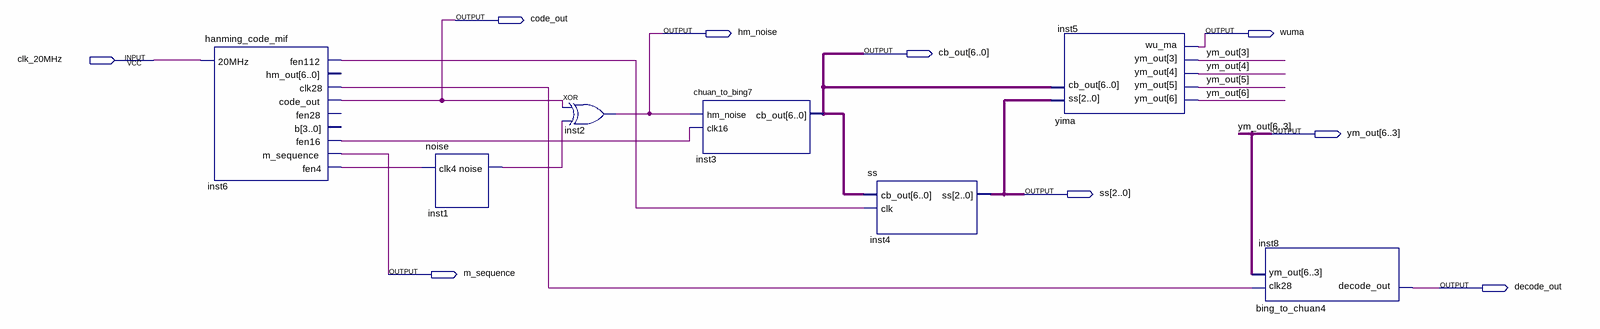
[diagram p0: schematic sheet]
// Quartus schematic hanming_decode_mif.bdf as structural Verilog: 7 symbols, 9 pins
module hanming_decode_mif (
  input  clk_20MHz,
  output code_out,
  output hm_noise,
  output wuma,
  output [6:0] cb_out,
  output [6:3] ym_out,
  output [2:0] ss,
  output m_sequence,
  output decode_out
);

  wire inst1_noise, inst6_clk28, inst6_fen4, inst6_fen16, inst6_fen112;

  hanming_code_mif inst6 (
    .\20MHz (clk_20MHz), .fen112(inst6_fen112), .clk28(inst6_clk28), .code_out(code_out),
    .fen16(inst6_fen16), .m_sequence(m_sequence), .fen4(inst6_fen4));  // open: hm_out, fen28, b
  noise inst1 (.clk4(inst6_fen4), .noise(inst1_noise));
  xor inst2 (hm_noise, code_out, inst1_noise);
  chuan_to_bing7 inst3 (.hm_noise(hm_noise), .clk16(inst6_fen16), .cb_out(cb_out));
  ss inst4 (.cb_out(cb_out), .clk(inst6_fen112), .ss(ss));
  yima inst5 (.ss(ss), .cb_out(cb_out), .ym_out(ym_out), .wu_ma(wuma));
  bing_to_chuan4 inst8 (.clk28(inst6_clk28), .ym_out(ym_out), .decode_out(decode_out));
endmodule
